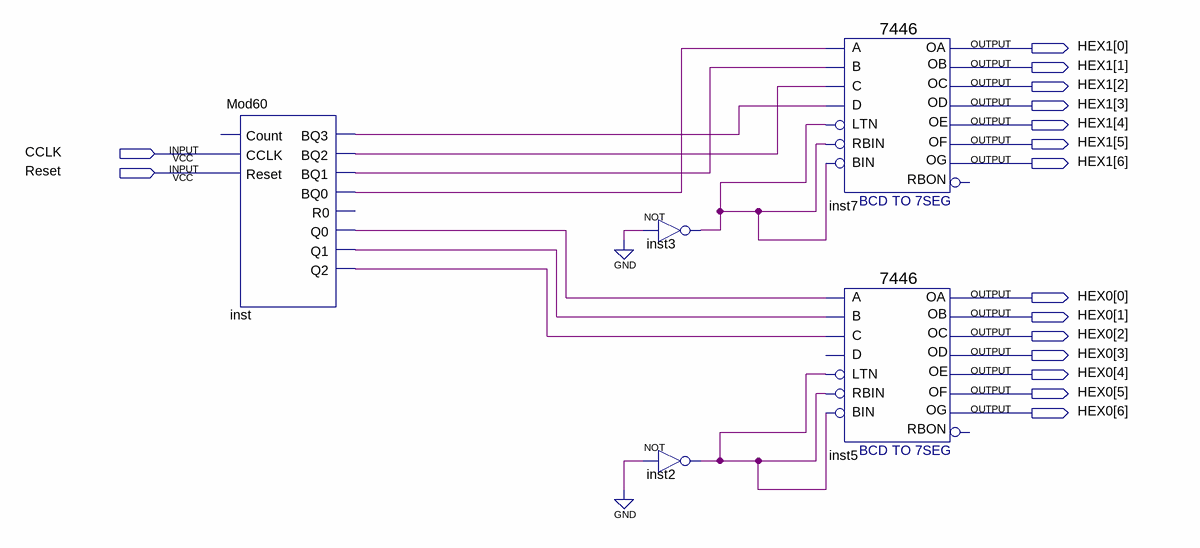
[diagram p0: schematic sheet]
// Quartus schematic 7segmod60.bdf as structural Verilog: 5 symbols, 16 pins
module \7segmod60  (
  input  CCLK,
  input  Reset,
  output [6:0] HEX1,
  output [6:0] HEX0
);

  wire inst2_out, inst3_out, inst_bq0, inst_bq1, inst_bq2, inst_bq3, inst_q0, inst_q1, inst_q2;

  Mod60 inst (
    .CCLK(CCLK), .Reset(Reset), .BQ3(inst_bq3), .BQ2(inst_bq2), .BQ1(inst_bq1), .BQ0(inst_bq0), .Q0(inst_q0),
    .Q1(inst_q1), .Q2(inst_q2));  // open: Count, R0
  not inst3 (inst3_out, 1'b0);
  not inst2 (inst2_out, 1'b0);
  \7446  inst7 (
    .D(inst_bq3), .C(inst_bq2), .B(inst_bq1), .LTN(inst3_out), .A(inst_bq0), .RBIN(inst3_out),
    .BIN(inst3_out), .OC(HEX1[2]), .OD(HEX1[3]), .OE(HEX1[4]), .OA(HEX1[0]), .OB(HEX1[1]), .OF(HEX1[5]),
    .OG(HEX1[6]));  // open: RBON
  \7446  inst5 (
    .C(inst_q2), .B(inst_q1), .LTN(inst2_out), .A(inst_q0), .RBIN(inst2_out), .BIN(inst2_out), .OC(HEX0[2]),
    .OD(HEX0[3]), .OE(HEX0[4]), .OA(HEX0[0]), .OB(HEX0[1]), .OF(HEX0[5]), .OG(HEX0[6]));  // open: D, RBON
endmodule
